# EasyEDA Pro project 小张FOC-STM32G431CBU6.epro, board PCB5
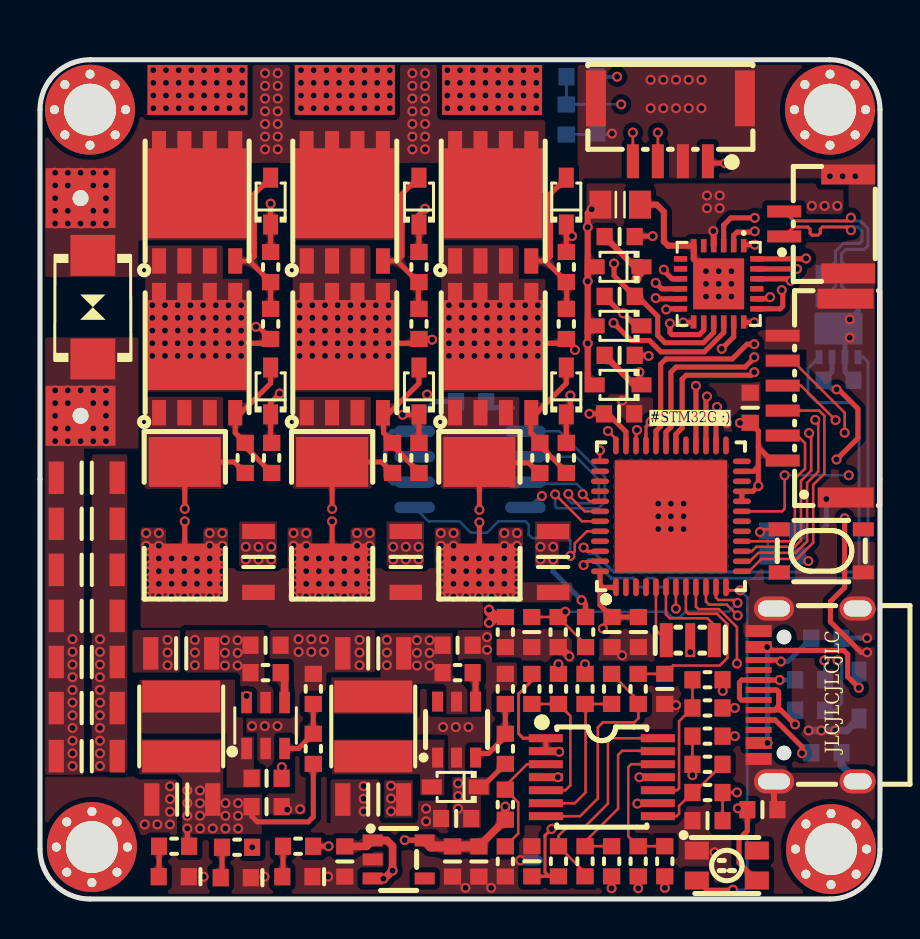
[diagram p13: board, top side]
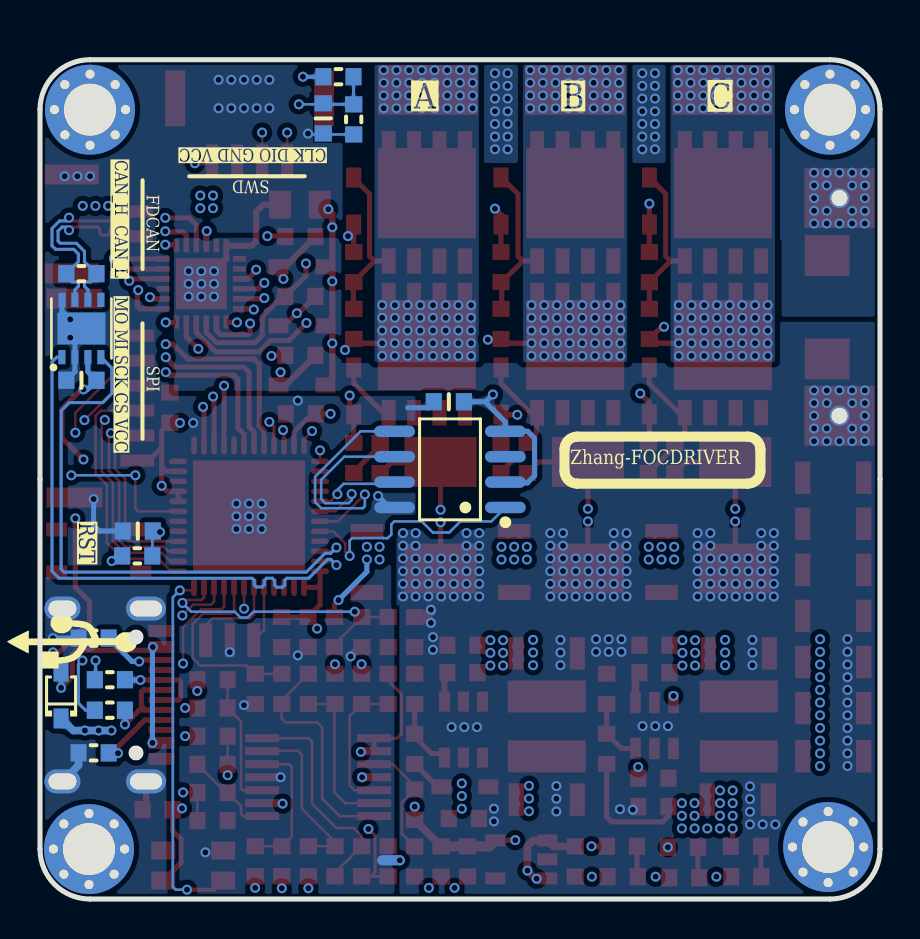
[diagram p14: board, bottom side, seen from below]

Outline 42 x 42 mm; copper layers: Top Layer, Inner1, Inner2, Bottom Layer. Coordinates in mm from the lower left corner of the outline.
Outline path: 0,39.5 0,2.5 arc(0.73,0.73) 2.5,0 39.5,0 arc(41.27,0.73) 42,2.5 42,39.5 arc(41.27,41.27) 39.5,42 2.5,42 arc(0.73,41.27) 0,39.5
Stack: Top Layer 0.035mm 外层铜厚1oz / Dielectric1 0.2104mm 7628 RC49% 8.6mil / Inner1 0.0152mm 内层铜厚 / Dielectric2 1.065mm 1.1mm H/HOZ Copper / Inner2 0.0152mm 内层铜厚 / Dielectric3 0.2104mm 7628 RC49% 8.6mil / Bottom Layer 0.035mm 外层铜厚1oz

## Design rules (mm)
net FDCAN_L: DP1
net FDCAN_H: DP1
net USB-DM: DP3
net USB-DP: DP3
net FDCAN_RX: DP2
net FDCAN_TX: DP2
template: 自定义配置
spacing copperThickness1oz (default): track to track 0.102, other pairs 0.102 to 0.127
spacing copperThickness2oz: track to track 0.203, other pairs 0.152 to 0.3
track width copperThickness1oz (default): min 0.127, default 0.127, max 2.54
track width copperThickness2oz: min 0.203, default 0.254, max 2.54
differential pair differentialPair (default): width min 0.127, default 0.152, max 2.54; gap min 0.152, default 0.152
via viaSize (default): diameter min 0.399, default 0.5, max 10; hole min 0.3, default 0.3, max 6.299

## Placement (name value [footprint] x y rotation side)
C5  100nF  [C0603_SMALL]  20.81 4.03 180 top
C6  100nF  [C0603_SMALL]  11.33 6.04 0 top
C8  1uF  [C0603_SMALL]  15.24 1.88 90 top
C9  1uF  [C0603_SMALL]  20.62 1.88 90 top
C16  100nF  [C0603_SMALL]  11.33 4.62 0 top
C17  10uF  [C1206_SMALL]  18.29 16.87 270 top
C18  10uF  [C1206_SMALL]  25.65 16.87 270 top
C19  10uF  [C1206_SMALL]  2.34 16.47 180 top
C20  10uF  [C1206_SMALL]  2.34 14.17 180 top
C21  10uF  [C1206_SMALL]  2.34 9.56 180 top
C22  10uF  [C1206_SMALL]  2.34 18.78 180 top
C23  10uF  [C1206_SMALL]  2.34 11.86 180 top
C24  10uF  [C1206_SMALL]  2.34 7.15 180 top
C25  10uF  [C1206_SMALL]  2.34 21.08 180 top
C26  10uF  [C1206_SMALL]  10.92 16.87 270 top
C27  100nF  [C0603_SMALL]  39.93 25.96 180 bottom
C28  100nF  [C0603_SMALL]  28.96 24.28 180 top
C29  100nF  [C0603_SMALL]  28.6 13.36 90 top
C30  100nF  [C0603_SMALL]  29.92 13.36 90 top
C31  100nF  [C0603_SMALL]  35.51 24.59 270 top
C34  1uF  [C0603_SMALL]  28.98 27.2 0 top
C35  1uF  [C0805_SMALL]  29.01 34.75 180 top
C36  100nF  [C0603_SMALL]  21.56 24.88 180 bottom
C37  1uF  [C0603_SMALL]  28.98 30.16 0 top
C38  1uF  [C0603_SMALL]  28.98 33.15 0 top
C43  100nF  [C0603_SMALL]  36.12 4.47 0 top
C44  100nF  [C0603_SMALL]  24.59 13.36 270 top
C45  100nF  [C0603_SMALL]  27.84 39.06 270 bottom
C62  1nF  [C0603_S]  31.24 10.52 90 top
C67  1nF  [C0603_S]  24.59 1.88 270 top
C68  1nF  [C0603_S]  33.38 3.92 0 top
C69  22uF  [C1206_SMALL]  7.06 12.29 180 top
C70  22uF  [C1206_SMALL]  7.11 4.98 180 top
C71  22uF  [C1206_SMALL]  16.66 12.29 180 top
C72  22uF  [C1206_SMALL]  16.66 4.98 180 top
C73  100nF  [C0603_SMALL]  11.28 12.7 0 top
C74  100nF  [C0603_SMALL]  20.88 12.7 0 top
C75  100nF  [C0603_SMALL]  21.95 1.88 270 top
C76  100nF  [C0603_SMALL]  37.11 18.42 180 bottom
CN1  WAFER-GH1.25-6PWB  [CONN-SMD_6P-P1.25_XUNPU_WAFER-GH1.25-6PWB]  38.71 25.07 90 top
CN2  X1251WRS-02HF-LPSW  [CONN-SMD_2P-P1.25_X1251WRS-02HF-LPSW]  38.81 33.78 90 top
D1  SMBJ28CA  [SMB_L4.6-W3.6-LS5.3-BI]  2.64 29.62 270 top
D2  B16WS  [SOD-323_L1.8-W1.3-LS2.5-RD]  28.9 25.73 180 top
D3  B16WS  [SOD-323_L1.8-W1.3-LS2.5-RD]  28.9 28.68 180 top
D4  B16WS  [SOD-323_L1.8-W1.3-LS2.5-RD]  40.94 10.21 90 bottom
D5  B16WS  [SOD-323_L1.8-W1.3-LS2.5-RD]  28.9 31.64 180 top
D6  B16WS  [SOD-323_L1.8-W1.3-LS2.5-RD]  11.53 34.93 90 top
D7  B16WS  [SOD-323_L1.8-W1.3-LS2.5-RD]  18.95 34.93 90 top
D8  B16WS  [SOD-323_L1.8-W1.3-LS2.5-RD]  26.31 34.93 90 top
D9  B16WS  [SOD-323_L1.8-W1.3-LS2.5-RD]  11.53 25.43 90 top
D10  B16WS  [SOD-323_L1.8-W1.3-LS2.5-RD]  18.95 25.43 90 top
D11  B16WS  [SOD-323_L1.8-W1.3-LS2.5-RD]  26.31 25.43 90 top
D13  B16WS  [SOD-323_L1.8-W1.3-LS2.5-RD]  20.76 5.61 180 top
L4  NCD0603R1  [LED0603_S]  13.5 1.12 0 top
L5  NCD0603R1  [LED0603_S]  7.31 1.12 0 top
L6  NCD0603R1  [LED0603_S]  10.41 1.07 0 top
L7  4.7uH  [IND-SMD_L4.0-W4.0_FNR40XXS]  7.06 8.64 270 top
L8  10uH  [IND-SMD_L4.0-W4.0_FNR40XXS]  16.66 8.64 270 top
LED1  XL-3528RGBW-WS2812B  [LED-SMD_4P-L3.5-W2.8-BR-1]  34.34 1.68 180 top
NOREF  -  [Pad_e358]  2.03 35.07 0 top
NOREF#2  -  [Pad_e196]  22.61 40.49 90 top
NOREF#3  -  [Pad_e381]  2.03 24.18 0 top
NOREF#4  -  [Pad_e195]  15.24 40.49 90 top
NOREF#5  -  [Pad_e181]  2.03 24.18 0 top
NOREF#6  -  [Pad_e194]  7.87 40.49 90 top
NOREF#7  -  [Pad_e180]  2.03 35.07 0 top
NTC1  NCP18XH103F03RB  [R0603_SMALL]  26.31 39.01 270 bottom
Q1  CSD18540Q5B  [VSON-CLIP-8_L5.0-W6.0-P1.27-BL]  7.86 34.93 0 top
Q2  CSD18540Q5B  [VSON-CLIP-8_L5.0-W6.0-P1.27-BL]  15.24 34.93 0 top
Q3  CSD18540Q5B  [VSON-CLIP-8_L5.0-W6.0-P1.27-BL]  22.66 34.93 0 top
Q4  CSD18540Q5B  [VSON-CLIP-8_L5.0-W6.0-P1.27-BL]  7.86 27.33 0 top
Q5  CSD18540Q5B  [VSON-CLIP-8_L5.0-W6.0-P1.27-BL]  15.24 27.33 0 top
Q6  CSD18540Q5B  [VSON-CLIP-8_L5.0-W6.0-P1.27-BL]  22.66 27.33 0 top
R2  100kΩ  [R0603_SMALL]  20.88 11.33 0 top
R3  200kΩ  [R0603_SMALL]  23.27 7.52 90 top
R4  10kΩ  [R0603_SMALL]  23.27 10.52 90 top
R6  100kΩ  [R0603_SMALL]  11.28 11.33 0 top
R7  52.3kΩ  [R0603_SMALL]  13.66 7.52 90 top
R8  10kΩ  [R0603_SMALL]  13.66 10.52 90 top
R9  120R  [R0603_SMALL]  39.93 31.29 0 bottom
R10  0Ω  [R0603_SMALL]  23.27 13.36 270 top
R11  4.7kΩ  [R0603_SMALL]  39.32 13.06 180 bottom
R12  22Ω  [R0603_SMALL]  38.51 9.45 0 bottom
R13  22Ω  [R0603_SMALL]  38.51 10.97 0 bottom
R14  4.7kΩ  [R0603_SMALL]  39.32 7.31 0 bottom
R19  22Ω  [R0603_SMALL]  11.53 31.62 270 top
R20  22Ω  [R0603_SMALL]  18.95 31.63 270 top
R21  22Ω  [R0603_SMALL]  26.31 31.63 270 top
R28  10kΩ  [R0603_SMALL]  11.53 28.78 90 top
R29  10kΩ  [R0603_SMALL]  18.95 28.78 90 top
R30  10kΩ  [R0603_SMALL]  26.31 28.78 90 top
R32  22Ω  [R0603_SMALL]  11.58 22.07 270 top
R33  22Ω  [R0603_SMALL]  18.95 22.07 270 top
R34  22Ω  [R0603_SMALL]  26.31 22.08 270 top
R37  10kΩ  [R0603_SMALL]  10.26 22.08 90 top
R38  10kΩ  [R0603_SMALL]  17.63 22.08 90 top
R39  10kΩ  [R0603_SMALL]  24.99 22.08 90 top
R42  100kΩ  [R0603_S]  28.58 10.52 270 top
R44  1mΩ  [RES-SMD_L6.4-W3.2_LR2512D-3W-1MR]  7.24 19.2 90 top
R45  1mΩ  [RES-SMD_L6.4-W3.2_LR2512D-3W-1MR]  14.6 19.2 90 top
R46  1mΩ  [RES-SMD_L6.4-W3.2_LR2512D-3W-1MR]  21.97 19.2 90 top
R48  10kΩ  [R0603_SMALL]  27.28 13.36 90 top
R49  10kΩ  [R0603_SMALL]  27.08 41.15 180 bottom
R50  1kΩ  [R0603_SMALL]  12.9 2.64 180 top
R51  1kΩ  [R0603_SMALL]  25.91 13.36 270 top
R52  1kΩ  [R0603_SMALL]  6.71 2.64 180 top
R53  1kΩ  [R0603_SMALL]  9.85 2.59 180 top
R55  100kΩ  [R0603_S]  24.59 10.52 270 top
R65  100kΩ  [R0603_S]  27.25 1.89 90 top
R66  100kΩ  [R0603_S]  33.38 6.74 180 top
R67  2kΩ  [R0603_S]  28.58 1.89 90 top
R68  2kΩ  [R0603_S]  33.38 8.15 180 top
R69  2kΩ  [R0603_S]  29.91 1.89 90 top
R70  22Ω  [R0603_S]  25.92 1.89 90 top
R71  100kΩ  [R0603_S]  31.24 1.89 90 top
R72  2kΩ  [R0603_S]  33.38 9.56 180 top
R73  22Ω  [R0603_S]  33.38 5.33 180 top
R74  100kΩ  [R0603_S]  33.38 10.97 180 top
R76  2kΩ  [R0603_S]  27.25 10.52 270 top
R78  2kΩ  [R0603_S]  25.92 10.52 270 top
R79  10kΩ  [R0603_S]  23.27 1.88 90 top
R81  22Ω  [R0603_S]  29.91 10.52 270 top
R82  10kΩ  [R0603_S]  23.27 4.72 270 top
R83  10kΩ  [R0603_S]  37.13 17.17 0 bottom
SW2  SKRPACE010  [KEY-SMD_4P-L4.2-W3.2-P2.20-LS4.6]  39.06 17.42 0 top
TP1  -  [M2.5螺丝孔]  2.5 39.5 0 top
TP2  -  [M2.5螺丝孔]  2.59 2.6 0 top
TP3  -  [M2.5螺丝孔]  39.55 2.5 0 top
TP4  -  [M2.5螺丝孔]  39.5 39.5 0 top
U2  STM32G431CBU6U  [UFQFPN-48_L7.0-W7.0-P0.50-BL-EP5.6]  31.55 19.15 0 top
U3  XC6210B332MR  [SOT-23-5_L3.0-W1.7-P0.95-LS2.8-BR]  17.93 1.98 180 top
U5  RY8411  [SOT-23-6_L2.9-W1.6-P0.95-LS2.8-BL]  11.28 8.68 0 top
U7  FD6288Q  [QFN-24_L4.0-W4.0-P0.50-BL-EP2.6]  33.93 30.78 180 top
U8  MT6816CT-ACD  [SOP-8_L5.0-W4.0-P1.27-LS6.0-BL]  21.5 21.5 90 bottom
U11  TJA1051TK/3/1J  [HVSON-8_L3.0-W3.0-P0.65-BL-EP]  39.93 28.55 180 bottom
U13  RS624XQ  [TSSOP-14_L5.0-W4.4-P0.65-LS6.4-BL]  28.09 6.1 270 top
U14  WAFER-GH1.25-4PWB  [CONN-SMD_4P-P1.25_XUNPU_WAFER-GH1.25-4PWB]  31.52 38.49 180 top
U19  MT3608  [SOT-23-6_L2.9-W1.6-P0.95-LS2.8-BR]  20.83 8.48 270 top
USBC1  TYPE-C-31-M-12  [USB-C_SMD-TYPE-C-31-M-12]  38.41 10.21 90 top
X1  20MHz  [OSC-SMD_3P-L3.2-W1.3-P1.2-L]  32.51 12.95 0 top

## Footprints (pads in the part's own frame, mm; a bottom-side part is the same pattern mirrored in y, then rotated)
C0603_S
  rect 0.806x0.864 smd: 1(-0.762,0) 2(0.745,0)
C0603_SMALL
  rect 0.806x0.864 smd: 1(-0.753,0) 2(0.753,0)
C0805_SMALL
  rect 1.1x1.399 smd: 1(-0.991,0) 2(0.991,0)
C1206_SMALL
  rect 0.762x1.625 smd: 1(-1.524,0) 2(1.524,0)
CONN-SMD_2P-P1.25_X1251WRS-02HF-LPSW
  rect 0.6x1.7 smd: 1(-0.625,1.6) 2(0.625,1.6)
  rect 1x2.7 smd: 3(2.475,-1.6) 4(-2.475,-1.6)
CONN-SMD_4P-P1.25_XUNPU_WAFER-GH1.25-4PWB
  rect 0.6x1.7 smd: 1(-1.875,1.575) 2(-0.625,1.575) 3(0.625,1.575) 4(1.875,1.575)
  rect 1x2.8 smd: 5(3.725,-1.575) 6(-3.725,-1.575)
CONN-SMD_6P-P1.25_XUNPU_WAFER-GH1.25-6PWB
  rect 0.6x1.7 smd: 1(-3.125,1.575) 2(-1.875,1.575) 3(-0.625,1.575) 4(0.625,1.575) 5(1.875,1.575) 6(3.125,1.575)
  rect 1x2.8 smd: 7(4.975,-1.575) 8(-4.975,-1.575)
HVSON-8_L3.0-W3.0-P0.65-BL-EP
  rect 0.355x0.711 smd: 1(-0.975,-1.433) 2(-0.325,-1.433) 3(0.325,-1.433) 4(0.975,-1.433) 5(0.975,1.433) 6(0.325,1.433) 7(-0.325,1.433) 8(-0.975,1.433)
  rect 2.4x1.6 smd: 9(0,0)
IND-SMD_L4.0-W4.0_FNR40XXS
  rect 1.6x3.9 smd: 1(-1.5,0) 2(1.5,0)
KEY-SMD_4P-L4.2-W3.2-P2.20-LS4.6
  rect 1.05x0.7 smd: 1(-2.1,1.075) 2(2.1,1.075) 3(-2.1,-1.075) 4(2.1,-1.075)
LED0603_S
  rect 0.806x0.864 smd: 1(-1.381,-0.001) 2(0.126,-0.001)
LED-SMD_4P-L3.5-W2.8-BR-1
  rect 1.2x0.9 smd: 1(1.5,-0.75) 2(1.5,0.75) 3(-1.5,0.75) 4(-1.5,-0.75)
M2.5螺丝孔
  round 0.635 hole 0.457: (-1.778,0) (-1.257,1.257) (-1.257,-1.257) (0,1.778) (0,-1.778) (1.257,1.257) (1.257,-1.257) (1.778,0)
  round 4.5 hole 2.6: 0(0,0)
OSC-SMD_3P-L3.2-W1.3-P1.2-L
  rect 0.65x1.7 smd: 1(-1.2,0) 3(1.2,0)
  rect 0.5x1.7 smd: 2(0,0)
Pad_e180
  rect 3.5x3 smd: 1(0,0)
Pad_e181
  rect 3.5x3 smd: 2(0,0)
Pad_e194
  rect 2.5x5 smd: 1(0,0)
Pad_e195
  rect 2.5x5 smd: 2(0,0)
Pad_e196
  rect 2.5x5 smd: 3(0,0)
Pad_e358
  round 1 hole 0.8: 1(0,0)
Pad_e381
  round 1 hole 0.8: 1(0,0)
QFN-24_L4.0-W4.0-P0.50-BL-EP2.6
  rect 0.28x0.665 smd: 1(-1.25,-1.907) 2(-0.75,-1.907) 3(-0.25,-1.907) 4(0.25,-1.907) 5(0.75,-1.907) 6(1.25,-1.907) 13(1.25,1.907) 14(0.75,1.907) 15(0.25,1.907) 16(-0.25,1.907) 17(-0.75,1.907) 18(-1.25,1.907)
  rect 0.665x0.28 smd: 7(1.907,-1.25) 8(1.907,-0.75) 9(1.907,-0.25) 10(1.907,0.25) 11(1.907,0.75) 12(1.907,1.25) 19(-1.907,1.25) 20(-1.907,0.75) 21(-1.907,0.25) 22(-1.907,-0.25) 23(-1.907,-0.75) 24(-1.907,-1.25)
  rect 2.55x2.55 smd: 25(0,0)
R0603_S
  rect 0.806x0.864 smd: 1(-0.752,0) 2(0.754,0)
R0603_SMALL
  rect 0.806x0.864 smd: 1(-0.753,0) 2(0.753,0)
RES-SMD_L6.4-W3.2_LR2512D-3W-1MR
  rect 2.5x3.6 smd: 1(-2.667,0) 2(2.667,0)
SMB_L4.6-W3.6-LS5.3-BI
  rect 2.047x2.241 smd: 1(-2.591,0) 2(2.591,0)
SOD-323_L1.8-W1.3-LS2.5-RD
  rect 1x0.75 smd: 1(-1.173,0) 2(1.173,0)
SOP-8_L5.0-W4.0-P1.27-LS6.0-BL
  oval 0.574x2.035 smd: 1(-1.905,-2.768) 2(-0.635,-2.768) 3(0.635,-2.768) 4(1.905,-2.768) 5(1.905,2.768) 6(0.635,2.768) 7(-0.635,2.768) 8(-1.905,2.768)
SOT-23-5_L3.0-W1.7-P0.95-LS2.8-BR
  rect 1x0.6 smd: 1(1.3,-0.95) 2(1.3,0) 3(1.3,0.95) 4(-1.3,0.95) 5(-1.3,-0.95)
SOT-23-6_L2.9-W1.6-P0.95-LS2.8-BL
  rect 0.532x1.072 smd: 1(-0.95,-1.149) 2(0,-1.149) 3(0.95,-1.149) 4(0.95,1.149) 5(0,1.149) 6(-0.95,1.149)
SOT-23-6_L2.9-W1.6-P0.95-LS2.8-BR
  rect 1x0.55 smd: 1(1.4,-0.95) 2(1.4,0) 3(1.4,0.95) 4(-1.4,0.95) 5(-1.4,0) 6(-1.4,-0.95)
TSSOP-14_L5.0-W4.4-P0.65-LS6.4-BL
  rect 0.4x1.7 smd: 1(-1.95,-2.8) 2(-1.3,-2.8) 3(-0.65,-2.8) 4(0,-2.8) 5(0.65,-2.8) 6(1.3,-2.8) 7(1.95,-2.8) 8(1.95,2.8) 9(1.3,2.8) 10(0.65,2.8) 11(0,2.8) 12(-0.65,2.8) 13(-1.3,2.8) 14(-1.95,2.8)
UFQFPN-48_L7.0-W7.0-P0.50-BL-EP5.6
  oval 0.28x0.9 smd: 1(-2.751,-3.547) 2(-2.251,-3.547) 3(-1.75,-3.547) 4(-1.25,-3.547) 5(-0.75,-3.547) 6(-0.249,-3.547) 7(0.249,-3.547) 8(0.75,-3.547) 9(1.25,-3.547) 10(1.75,-3.547) 11(2.251,-3.547) 12(2.751,-3.547) 25(2.751,3.547) 26(2.251,3.547) 27(1.75,3.547) 28(1.25,3.547) 29(0.75,3.547) 30(0.249,3.547) 31(-0.249,3.547) 32(-0.75,3.547) 33(-1.25,3.547) 34(-1.75,3.547) 35(-2.251,3.547) 36(-2.751,3.547)
  oval 0.9x0.28 smd: 13(3.547,-2.75) 14(3.547,-2.25) 15(3.547,-1.75) 16(3.547,-1.25) 17(3.547,-0.75) 18(3.547,-0.25) 19(3.547,0.25) 20(3.547,0.75) 21(3.547,1.25) 22(3.547,1.75) 23(3.547,2.25) 24(3.547,2.75) 37(-3.547,2.751) 38(-3.547,2.251) 39(-3.547,1.75) 40(-3.547,1.25) 41(-3.547,0.75) 42(-3.547,0.249) 43(-3.547,-0.249) 44(-3.547,-0.75) 45(-3.547,-1.25) 46(-3.547,-1.75) 47(-3.547,-2.251) 48(-3.547,-2.751)
  rect 5.6x5.6 smd: 49(0,0)
USB-C_SMD-TYPE-C-31-M-12
  oval 1.2x2 hole 0.8x1.6: 0(-4.325,1.706) 1(4.325,1.706)
  oval 1.2x1.8 hole 0.8x1.4: 2(4.325,-2.474) 3(-4.325,-2.474)
  rect 0.3x1.3 smd: A1(-3.35,2.474) A4(-2.55,2.474) A5(-1.25,2.474) A6(-0.25,2.474) A7(0.25,2.474) A8(1.25,2.474) A9(2.55,2.474) A12(3.35,2.474) B1(3.05,2.474) B4(2.25,2.474) B5(1.75,2.474) B6(0.75,2.474) B7(-0.75,2.474) B8(-1.75,2.474) B9(-2.25,2.474) B12(-3.05,2.474)
VSON-CLIP-8_L5.0-W6.0-P1.27-BL
  rect 0.7x1.27 smd: 1(-1.904,-3) 2(-0.636,-3) 3(0.636,-3) 4(1.906,-3)
  rect 0.7x1 smd: 5(1.904,3) 6(0.634,3) 7(-0.636,3) 8(-1.906,3)
  rect 4.9x4.5 smd: 8(-0.001,0.39)

## Nets
As in the schematic, except:
PGND: C5.2 C16.2 C17.2 C18.2 C19.2 C20.2 C21.2 C22.2 C23.2 C24.2 C25.2 C26.2 C35.1 C69.2 C70.2 C71.2 C72.2 C73.2 C74.2 D1.2 NOREF#3.1 NOREF#5.2 R4.2 R8.2 R10.1 R44.1 R45.1 R46.1 R67.1 R68.1 R76.1 U5.2 U7.6 U7.25 U19.2
DCBUS: C17.1 C18.1 C19.1 C20.1 C21.1 C22.1 C23.1 C24.1 C25.1 C26.1 C69.1 C73.1 D1.1 NOREF.1 NOREF#7.1 Q1.5 Q1.6 Q1.7 Q1.8 Q2.5 Q2.6 Q2.7 Q2.8 Q3.5 Q3.6 Q3.7 Q3.8 R6.1 R48.2 U5.5
SH_A: C34.2 NOREF#2.3 Q3.1 Q3.2 Q3.3 Q6.5 Q6.6 Q6.7 Q6.8 R30.1 U7.18
SH_B: C37.2 NOREF#4.2 Q2.1 Q2.2 Q2.3 Q5.5 Q5.6 Q5.7 Q5.8 R29.1 U7.15
SH_C: C38.2 NOREF#6.1 Q1.1 Q1.2 Q1.3 Q4.5 Q4.6 Q4.7 Q4.8 R28.1 U7.12

Pads without a net: LED1 4; SW2 2 3; TP1 0; TP2 0; TP3 0; TP4 0; U2 3 4 17 18 25 29 38 39 40 45; U3 4; U7 5 7 8 21; U8 3; U11 5; U19 6; USBC1 A8 B8

## Via types
v1: diameter 0.5, hole 0.299, Top Layer to Bottom Layer, 688 vias

## Routing (per net, layer and track width the routed paths; a pad name or vN(x,y) marks a point on that pad's centre or on a via; arc(x,y) is an arc through that point)
5V: length 37.4
  Top Layer w0.254: v1(40.23,19.05) 40.23,15.6 39.52,14.88 39.52,13.87 41.05,12.34 v1(41.35,12.34) ; R7.1 13.66,4.11 13.41,3.86 10.87,3.86 10.58,4.16 C16.1 ; 7.46,2.64 7.37,2.73 v1(7.37,3.53) ; LED1.3 34.95,1.82 34.95,3 35.37,3.41 C43.1 35.3,4.54 v1(34.9,4.54) ; v1(39.83,25.5) 39.93,25.5 40.89,24.54 40.89,23.06 v1(39.83,22)
  Top Layer w0.381: C8.2 16.33,2.63 U3.1 17.35,2.93 17.63,2.65 v1(17.63,1.42) 17.22,1.02 v1(17.17,1.02) 16.65,1.02 16.63,1.03
  Inner2 w0.254: v1(39.83,22) 39.83,19.46 v1(40.23,19.05)
  Bottom Layer w0.254: v1(39.83,25.5) 39.63,25.5 C27.2 39.6,26.39 U11.3
  Bottom Layer w0.381: D4.1 40.34,8.43 v1(39.75,8.43) v1(39.06,8.43) v1(38.43,8.43)
  vias: v1(7.37,5.44) v1(7.37,4.8) v1(7.37,4.17) v1(8,5.44) v1(8,4.8) v1(8,4.17) v1(8,3.53) v1(8.64,3.53) v1(9.27,4.8) v1(9.27,4.17) v1(9.27,3.53) v1(9.91,4.8) v1(9.91,4.17) v1(9.91,3.53) v1(17.35,12.97) v1(17.35,12.33) v1(17.35,11.7) v1(18.85,12.95) v1(18.85,12.32) v1(18.85,11.68) v1(19.48,12.95) v1(19.48,12.32) v1(19.48,11.68)
12V: length 21.2
  Top Layer w0.254: R3.1 22.11,5.61 D13.1
  Top Layer w0.305: v1(33.66,33.43) 33.68,33.41 U7.4 ; 27.39,28.34 v1(27.39,27.81) 27.39,26.07 D2.2 ; 27.39,28.34 D3.2 ; 27.39,28.34 v1(27.39,30.91) 27.39,31.29 ; 27.39,31.29 D5.2 ; 27.39,31.29 v1(27.39,33.62) 27.39,34.32 v1(27.59,34.52) 28.02,34.95
  Inner2 w0.203: v1(10.61,2.59) 13.36,2.59 14.28,3.5 17.22,3.5 17.55,3.84 v1(17.55,4.39)
  vias: v1(17.55,5.66) v1(17.55,5.03) v1(20.91,5.79) v1(20.91,5.15) v1(20.91,4.52) v1(33.35,35.2) v1(33.35,34.57) v1(33.99,35.2) v1(33.99,34.57) v1(38.59,34.69) v1(39.23,34.69) v1(39.86,34.69)
GND: length 19
  Top Layer w0.127: C62.1 31.74,9.76 v1(31.8,9.7)
  Top Layer w0.254: v1(39.32,20.02) 39.4,20.09 CN1.8
  Top Layer w0.305: C43.2 36.7,4.64 USBC1.0
  Top Layer w0.381: v1(26.47,12.14) 26,12.61 R51.2
  Bottom Layer w0.127: 26.31,38.26 28.56,38.26 v1(28.6,38.3)
  Bottom Layer w0.254: U11.8 40.9,29.42 v1(40.49,29.01) ; C76.1 39.04,18.42 39.32,18.69 v1(39.32,20.02) ; 23.62,24.59 22.61,24.59 C36.1 ; R11.1 v1(41.35,13.06) ; U8.8 24.52,19.59 v1(25.09,20.17) ; C27.1 40.25,26.39 U11.2 40.25,27.86 v1(40.49,28.09)
  Bottom Layer w0.381: USBC1.3 40.07,6.69 R14.2
  Bottom Layer w0.508: 24.89,1.94 v1(24.01,1.94)
  vias: v1(8.18,1.12) v1(11.22,1.12) v1(14.41,1.12) v1(21.27,0.56) v1(22.56,0.56) v1(29.11,24.94) v1(29.11,12.19) v1(29.97,6.1) v1(30.53,41) v1(30.53,39.57) v1(30.91,19.79) v1(30.91,19.15) v1(30.91,18.52) v1(31.17,41) v1(31.17,39.57) v1(31.55,19.79) v1(31.55,19.15) v1(31.55,18.52) v1(31.8,41) v1(31.8,39.57) v1(32.18,19.79) v1(32.18,19.15) v1(32.18,18.52) v1(32.44,41) v1(32.44,39.57) v1(32.51,12.36) v1(33.07,41) v1(33.07,39.57) v1(33.73,2.34) v1(34.34,23.83) v1(39.5,36.17) v1(40.13,36.17) v1(40.77,36.17)
PGND: length 125.7
  Top Layer w0.254: R76.1 v1(27.25,11.75) ; R45.1 v1(14.6,18.9) ; R44.1 v1(7.24,18.9) ; 21.97,16.49 v1(21.97,18.85) ; R68.1 v1(34.74,8.15) ; R67.1 v1(28.58,0.54)
  Top Layer w0.305: v1(33.93,30.78) v1(33.3,31.42) 32.68,32.03 U7.6 31.41,32.69 31.19,32.91 31.19,34.39 30.84,34.75 C35.1
  Top Layer w0.508: v1(22.45,13.82) 22.75,14.11 ; 22.75,14.11 R10.1 ; 22.75,14.11 22.45,14.41 v1(22.45,14.48)
  Inner2 w0.152: v1(14.6,18.9) 14.81,18.9 16.64,20.73 27.99,20.73 28.68,20.04 28.68,13.43 28.33,13.08 25.09,13.08 24.84,12.84 24.84,9.54 25.63,8.76 34.14,8.76 v1(34.74,8.15) ; v1(21.97,18.85) 22.13,19.01 26.56,19.01 27.69,17.88 27.69,14.15 27.42,13.88 24.55,13.88 24.18,13.51 24.18,2.62 25.02,1.78 28.78,1.78 29.06,1.5 29.06,0.65 28.95,0.54 v1(28.58,0.54) ; v1(7.24,18.9) 7.4,19.06 7.91,19.06 10.34,21.49 28.8,21.49 29.6,20.69 29.6,11.04 29.18,10.61 26.85,10.61 26.74,10.72 26.74,11.24 v1(27.25,11.75)
  vias: v1(0.76,25.45) v1(0.76,24.82) v1(0.76,24.18) v1(0.76,23.55) v1(0.76,22.91) v1(1.39,25.45) v1(1.39,24.82) v1(1.39,23.55) v1(1.39,22.91) v1(1.63,13) v1(1.63,12.37) v1(1.63,11.73) v1(1.63,11.1) v1(1.63,10.47) v1(1.63,9.83) v1(1.63,9.19) v1(1.63,8.56) v1(1.63,7.92) v1(1.63,7.29) v1(1.63,6.66) v1(2.03,25.45) v1(2.03,22.91) v1(2.66,25.45) v1(2.66,24.82) v1(2.66,23.55) v1(2.66,22.91) v1(3.3,25.45) v1(3.3,24.82) v1(3.3,24.18) v1(3.3,23.55) v1(3.3,22.91) v1(5.23,3.73) v1(5.31,18.31) v1(5.31,17.68) v1(5.31,17.04) v1(5.31,16.41) v1(5.31,15.77) v1(5.31,15.14) v1(5.94,18.31) v1(5.94,17.68) v1(5.94,17.04) v1(5.94,16.41) v1(5.94,15.77) v1(5.94,15.14) v1(5.87,3.73) v1(6.38,12.97) v1(6.38,12.33) v1(6.38,11.7) v1(6.5,5.64) v1(6.5,5) v1(6.5,4.37) v1(6.5,3.73) v1(6.58,17.04) v1(6.58,16.41) v1(6.58,15.77) v1(6.58,15.14) v1(7.21,17.04) v1(7.21,16.41) v1(7.21,15.77) v1(7.21,15.14) v1(7.85,17.04) v1(7.85,16.41) v1(7.85,15.77) v1(7.85,15.14) v1(8.48,18.31) v1(8.48,17.68) v1(8.48,17.04) v1(8.48,16.41) v1(8.48,15.77) v1(8.48,15.14) v1(9.12,18.31) v1(9.12,17.68) v1(9.12,17.04) v1(9.12,16.41) v1(9.12,15.77) v1(9.12,15.14) v1(10.6,8.65) v1(11.24,8.65) v1(11.87,8.65) v1(12.36,4.47) v1(12.67,18.31) v1(12.67,17.68) v1(12.67,17.04) v1(12.67,16.41) v1(12.67,15.77) v1(12.67,15.14) v1(12.93,13) v1(12.93,12.37) v1(13,4.5) v1(13.31,18.31) v1(13.31,17.68) v1(13.31,17.04) v1(13.31,16.41) v1(13.31,15.77) v1(13.31,15.14) v1(13.56,13) v1(13.56,12.37) v1(13.94,17.04) v1(13.94,16.41) v1(13.94,15.77) v1(13.94,15.14) v1(14.2,13) v1(14.2,12.37) v1(14.58,17.04) v1(14.58,16.41) v1(14.58,15.77) v1(14.58,15.14) v1(15.21,17.04) v1(15.21,16.41) v1(15.21,15.77) v1(15.21,15.14) v1(15.85,18.31) v1(15.85,17.68) v1(15.85,17.04) v1(15.85,16.41) v1(15.85,15.77) v1(15.85,15.14) v1(15.98,12.97) v1(15.98,12.33) v1(15.98,11.7) v1(16.18,5.65) v1(16.18,5.02) v1(16.18,4.38) v1(16.48,18.31) v1(16.48,17.68) v1(16.48,17.04) v1(16.48,16.41) v1(16.48,15.77) v1(16.48,15.14) v1(19.3,4.52) v1(19.3,3.89) v1(20.04,18.31) v1(20.04,17.68) v1(20.04,17.04) v1(20.04,16.41) v1(20.04,15.77) v1(20.04,15.14) v1(20.15,8.61) v1(20.68,18.31) v1(20.68,17.68) v1(20.68,17.04) v1(20.68,16.41) v1(20.68,15.77) v1(20.68,15.14) v1(20.79,8.61) v1(21.31,17.04) v1(21.31,16.41) v1(21.31,15.77) v1(21.31,15.14) v1(21.42,8.61) v1(21.95,17.04) v1(21.95,16.41) v1(21.95,15.77) v1(21.95,15.14) v1(22.35,13.11) v1(22.35,12.47) v1(22.58,17.04) v1(22.58,16.41) v1(22.58,15.77) v1(22.58,15.14) v1(23.22,18.31) v1(23.22,17.68) v1(23.22,17.04) v1(23.22,16.41) v1(23.22,15.77) v1(23.22,15.14) v1(23.85,18.31) v1(23.85,17.68) v1(23.85,17.04) v1(23.85,16.41) v1(23.85,15.77) v1(23.85,15.14) v1(33.3,30.78) v1(33.3,30.15) v1(33.93,31.42) v1(33.93,30.15) v1(34.57,31.42) v1(34.57,30.78) v1(34.57,30.15)
VBUS: length 14.1
  Top Layer w0.127: v1(34.88,14.82) 34.73,14.96 33.92,14.96 33.8,15.09 33.8,15.6 ; R48.1 27.28,12.74 R51.1 C44.1
  Bottom Layer w0.127: v1(26.26,14.38) 31.32,14.38 31.61,14.09 31.98,14.09 32.27,14.38 34.44,14.38 v1(34.88,14.82)
VCC: length 46
  Top Layer w0.254: U3.5 18.63,2.93 18.61,2.95 v1(18.24,2.95) ; 35.92,21.64 35.92,22.6 ; 35.92,21.64 v1(35.92,20.68) 35.64,20.4 U2.21 U2.20 ; 35.92,21.64 35.68,21.4 U2.23 ; 35.92,22.6 35.92,23.43 35.51,23.83 35.5,23.83 v1(35,23.83) ; 35.92,22.6 36.57,21.94 CN1.1 ; C30.2 C29.2 28,14.71 28,15.74 ; 28,15.74 28.14,15.6 28.79,15.6 U2.1 ; 28,15.74 U2.48 ; v1(27.47,24.28) C28.2 28.4,24.28 29.3,23.38 U2.35 ; R50.1 v1(14.43,2.64) ; 33.43,36.83 34.24,36.83 v1(34.26,36.82)
  Top Layer w0.381: C75.1 22.1,2.78 22.1,2.79 23.27,3.96 v1(23.27,4.62)
  Top Layer w0.508: U3.5 19.53,2.63 C9.2 C75.1
  Inner2 w0.254: v1(27.47,24.28) 20.32,24.28 v1(19.35,25.25) ; v1(14.43,2.64) 14.73,2.95 v1(18.24,2.95)
  Bottom Layer w0.203: v1(28.85,41.15) R49.1
  Bottom Layer w0.254: v1(38.41,16.91) 38.16,17.17 37.89,17.17 ; 19.75,24.88 19.72,24.88 v1(19.35,25.25) ; 19.75,24.88 C36.2 ; 19.75,24.88 18.73,23.87 U8.4 17.61,23.41 17.27,23.06 17.27,21.18 17.63,20.83 18.69,20.83 U8.2
  vias: v1(25.89,6.1) v1(28.14,13.53)
DCBUS: length 3.5
  Top Layer w0.254: R48.2 27.28,14.76 v1(27.08,14.96)
  Bottom Layer w0.254: v1(25.66,16.99) 25.66,16.38 v1(27.08,14.96)
  vias: v1(0.76,36.34) v1(0.76,35.71) v1(0.76,35.07) v1(0.76,34.44) v1(0.76,33.8) v1(1.39,36.34) v1(1.39,35.71) v1(1.39,34.44) v1(1.39,33.8) v1(2.03,36.34) v1(2.03,33.8) v1(2.66,36.34) v1(2.66,35.71) v1(2.66,34.44) v1(2.66,33.8) v1(3,13) v1(3,12.37) v1(3,11.73) v1(3,11.1) v1(3,10.47) v1(3,9.83) v1(3,9.19) v1(3,8.56) v1(3,7.92) v1(3,7.29) v1(3,6.66) v1(3.3,36.34) v1(3.3,35.71) v1(3.3,35.07) v1(3.3,34.44) v1(3.3,33.8) v1(7.75,12.97) v1(7.75,12.33) v1(7.75,11.7) v1(9.25,12.95) v1(9.25,12.32) v1(9.25,11.68) v1(9.88,12.95) v1(9.88,12.32) v1(9.88,11.68) v1(10.29,17.62) v1(10.29,16.99) v1(10.93,17.62) v1(10.93,16.99) v1(11.25,41.33) v1(11.25,40.69) v1(11.25,40.06) v1(11.25,39.42) v1(11.25,38.79) v1(11.25,38.15) v1(11.25,37.52) v1(11.56,17.62) v1(11.56,16.99) v1(11.89,41.33) v1(11.89,40.69) v1(11.89,40.06) v1(11.89,39.42) v1(11.89,38.79) v1(11.89,38.15) v1(11.89,37.52) v1(17.66,17.62) v1(17.66,16.99) v1(18.29,17.62) v1(18.29,16.99) v1(18.62,41.33) v1(18.62,40.69) v1(18.62,40.06) v1(18.62,39.42) v1(18.62,38.79) v1(18.62,38.15) v1(18.62,37.52) v1(18.93,17.62) v1(18.93,16.99) v1(19.25,41.33) v1(19.25,40.69) v1(19.25,40.06) v1(19.25,39.42) v1(19.25,38.79) v1(19.25,38.15) v1(19.25,37.52) v1(25.02,17.62) v1(25.02,16.99) v1(25.66,17.62)
FDCAN_H: length 10
  Top Layer w0.152: CN2.2 37.68,33.93 40.39,33.93 v1(40.55,34.1)
  Bottom Layer w0.152: v1(40.55,34.1) 40.71,33.93 41.02,33.93 41.4,33.55 41.4,32.69 41.22,32.51 40.31,32.51 40.08,32.28 40.08,31.89 R9.2 40.68,31.17 40.4,30.88 40.15,30.88 40.08,30.81 40.08,30.66 40.25,30.49 U11.7
FDCAN_L: length 10
  Top Layer w0.152: CN2.1 37.68,33.63 38.4,33.63 38.5,33.52 38.5,33.33 38.61,33.22 38.9,33.22 39.01,33.33 39.01,33.52 39.12,33.63 40.39,33.63 v1(40.55,33.47)
  Bottom Layer w0.152: U11.6 39.6,30.49 39.78,30.66 39.78,30.81 39.71,30.88 39.46,30.88 39.18,31.17 R9.1 39.78,31.89 39.78,32.41 40.18,32.82 40.99,32.82 41.1,32.92 41.1,33.43 40.89,33.63 40.71,33.63 v1(40.55,33.47)
FDCAN_RX: length 28.1
  Top Layer w0.152: v1(27.18,17.59) 27.37,17.4 U2.46
  Bottom Layer w0.152: v1(27.18,17.59) 27.46,17.3 27.74,17.3 28.69,16.36 40.79,16.36 40.94,16.51 40.94,24.44 40.54,24.84 38.86,24.84 38.41,25.3 38.41,26.57 U11.4
FDCAN_TX: length 28.1
  Top Layer w0.152: U2.47 27.37,16.9 v1(27.18,16.71)
  Bottom Layer w0.152: U11.1 41.16,27.12 41.4,26.87 41.4,16.41 41.05,16.05 31.4,16.05 31.29,15.94 31.29,15.73 31.18,15.62 30.89,15.62 30.78,15.73 30.78,15.94 30.68,16.05 30.38,16.05 30.27,15.94 30.27,15.71 30.17,15.6 29.87,15.6 29.77,15.71 29.77,15.94 29.66,16.05 28.56,16.05 27.62,17 27.46,17 v1(27.18,16.71)
GH_A: length 18
  Top Layer w0.254: U7.19 37,29.53 37.13,29.67 37.13,30.42 v1(37.09,30.47) ; R21.1 26.31,33.46 ; 26.31,33.46 D8.1 ; 26.31,33.46 v1(26.6,33.17)
  Inner2 w0.254: v1(26.6,33.17) 26.6,32.63 31.14,28.09 33.63,28.09 36.22,30.68 36.88,30.68 v1(37.09,30.47)
GH_B: length 22.6
  Top Layer w0.254: v1(19.25,34.54) 18.95,34.24 D7.1 R20.1 ; U7.16 34.19,28.87 34.19,28.35 33.22,27.38 31.04,27.38 30.47,27.95 29.56,27.95 v1(28.68,28.83)
  Inner2 w0.254: v1(19.25,34.54) 25.55,34.54 26.01,34.09 26.01,31.5 v1(28.68,28.83)
GH_C: length 32.2
  Top Layer w0.254: U7.13 32.66,28.85 v1(32.16,28.85) ; v1(11.53,34.8) D6.1 11.53,32.38
  Inner2 w0.254: v1(32.16,28.85) 32.16,36.32 31.55,36.93 13.82,36.93 11.68,34.8 v1(11.53,34.8)
GL_A: length 10.4
  Top Layer w0.254: v1(30.78,30.07) 30.84,30.07 30.87,30.03 32.03,30.03 ; 26.37,22.83 26.31,22.88 D11.1 26.52,24.46 v1(26.52,25.2)
  Inner1 w0.254: v1(26.52,25.2) 30.78,29.46 v1(30.78,30.07)
GL_B: length 31.2
  Top Layer w0.254: 19,22.83 18.95,22.88 D10.1 18.93,24.23 v1(18.14,24.23) ; U7.10 31.08,30.53 v1(30.78,30.83)
  Inner2 w0.254: v1(18.14,24.23) 18.14,35.31 18.39,35.56 29.16,35.56 29.51,35.2 29.51,32.1 v1(30.78,30.83)
GL_C: length 35.7
  Top Layer w0.254: 32.03,31.03 31.6,31.03 31.19,31.44 v1(31.19,31.49) ; v1(11.99,25.3) 11.53,24.84 D9.1 11.53,22.88 11.58,22.83
  Inner2 w0.254: v1(31.19,31.49) 30.02,32.66 30.02,35.51 29.51,36.02 14.58,36.02 11.99,33.43 v1(11.99,25.3)
HIN1: length 15.6
  Top Layer w0.254: v1(35.71,27.77) 35.35,27.77 34.61,27.03 31.29,27.03 31.03,26.77 31.03,23.67 30.8,23.43 U2.32 ; v1(37.54,30.94) 37.44,31.03 35.84,31.03
  Inner2 w0.254: v1(37.54,30.94) 37.59,30.89 37.59,28.5 36.86,27.77 v1(35.71,27.77)
HIN2: length 16.4
  Top Layer w0.254: v1(35.71,27.11) 35.71,27.08 35.25,26.62 31.8,26.62 31.55,26.36 31.55,23.62 31.3,23.37 U2.31 ; U7.23 35.85,31.53 v1(37.85,31.53)
  Inner2 w0.254: v1(35.71,27.11) 36.92,27.11 38.05,28.25 38.05,31.33 v1(37.85,31.53)
HIN3: length 17.5
  Top Layer w0.254: v1(38.3,32.06) 38.28,32.03 35.84,32.03 ; U2.30 31.8,23.26 32.11,23.57 32.11,26.01 32.31,26.21 35.56,26.21 v1(35.71,26.36)
  Inner2 w0.254: v1(38.3,32.06) 38.51,31.85 38.51,27.64 37.24,26.36 v1(35.71,26.36)
IA: length 27.9
  Top Layer w0.127: v1(34.88,14.19) 34.34,14.73 33.45,14.73 33.3,14.89 U2.10
  Top Layer w0.152: 25.92,1.14 25.45,1.14 ; 25.45,1.14 25.25,1.34 25.25,3.17 v1(25.58,3.5) ; 25.45,1.14 24.59,1.14
  Inner2 w0.127: v1(34.88,14.19) 34.88,12.51 35.15,12.24 35.76,12.24 35.92,12.09 35.92,7.26 35.46,6.81 35.46,3.78 35.18,3.5 v1(25.58,3.5)
IA+: length 38.2
  Top Layer w0.254: R69.1 v1(29.91,0.54) ; v1(21.97,19.48) 21.97,21.82 24.44,21.82 24.99,21.28
  Inner2 w0.152: v1(29.91,0.54) 29.5,0.54 29.36,0.68 29.36,1.63 28.91,2.08 25.15,2.08 24.44,2.79 24.44,13.31 24.7,13.58 27.55,13.58 27.99,14.02 27.99,18.03 26.71,19.32 22.13,19.32 v1(21.97,19.48)
IB: length 14.8
  Top Layer w0.127: v1(34.85,5.33) 34.85,5.33 R73.1 ; v1(34.85,11.79) 34.85,13.6 33.94,14.51 32.92,14.51 32.8,14.63 U2.9 ; 34.13,5.33 C68.2
  Inner2 w0.127: v1(34.85,11.79) 35.46,11.79 35.61,11.63 35.61,7.42 34.85,6.66 v1(34.85,5.33)
IB+: length 45.9
  Top Layer w0.254: 34.23,9.56 v1(34.74,9.56) ; v1(14.6,19.53) R45.2 17.08,21.87 R38.1
  Inner2 w0.152: v1(14.6,19.53) 14.77,19.36 14.92,19.36 16.64,21.08 28.04,21.08 28.99,20.13 28.99,13.3 28.36,12.66 25.27,12.66 25.16,12.55 25.16,9.59 25.74,9.01 34.64,9.01 34.74,9.12 v1(34.74,9.56)
IC: length 10
  Top Layer w0.127: U2.8 32.3,14.39 32.41,14.28 33.85,14.28 34.37,13.76 34.37,12.07 33.99,11.68 31.65,11.68 C62.2 29.91,11.27
IC+: length 45.3
  Top Layer w0.254: v1(7.24,19.53) R44.2 9.71,21.87 R37.1 ; R78.1 v1(25.92,11.75)
  Inner2 w0.152: v1(25.92,11.75) 26.44,11.24 26.44,10.59 26.72,10.31 29.31,10.31 29.91,10.91 29.91,20.79 28.91,21.79 10.21,21.79 7.78,19.36 7.4,19.36 v1(7.24,19.53)
LIN1: length 18.9
  Top Layer w0.254: v1(35.74,32.74) 35.24,32.74 U7.1 ; U2.28 v1(32.8,25.68)
  Inner2 w0.254: v1(32.8,25.68) 37.47,25.68 38.96,27.18 38.96,32.26 38.48,32.74 v1(35.74,32.74)
LIN2: length 20.8
  Top Layer w0.254: v1(35.74,33.42) 35.7,33.38 34.85,33.38 34.68,33.21 U7.2 ; U2.27 33.3,25.09 v1(33.35,25.15)
  Inner2 w0.254: v1(33.35,25.15) 37.74,25.15 39.42,26.82 39.42,32.72 38.72,33.42 v1(35.74,33.42)
LIN3: length 22.7
  Top Layer w0.254: 33.8,22.7 33.8,24.58 v1(33.85,24.63) ; U7.3 34.18,33.73 34.54,34.09 v1(35.74,34.09)
  Inner2 w0.254: v1(33.85,24.63) 38.04,24.63 39.88,26.47 39.88,33.17 38.96,34.09 v1(35.74,34.09)
NRST: length 11.3
  Top Layer w0.127: SW2.1 36.14,18.5 v1(36,18.36) ; U2.7 v1(31.8,14.53)
  Inner2 w0.127: v1(31.8,14.53) 31.8,16.35 31.9,16.46 35.87,16.46 36,16.59 v1(36,18.36)
  Bottom Layer w0.127: R83.1 36.38,18.39 C76.2
NTC1: length 41.4
  Top Layer w0.127: U2.19 37.11,19.4 37.23,19.53 v1(37.23,21.2)
  Inner2 w0.127: v1(40.44,21.2) 41.18,21.2 41.48,21.51 41.48,36.45 41.2,36.73 38.2,36.73 34.65,40.28 29.57,40.28 v1(29.06,39.77)
  Bottom Layer w0.127: v1(40.44,21.2) v1(37.23,21.2) ; 27.89,39.77 v1(29.06,39.77)
  Bottom Layer w0.152: 27.79,39.77 NTC1.1 26.32,39.78 R49.2
OSC_IN: length 2.9
  Top Layer w0.127: X1.1 30.8,13.47 U2.5
OSC_OUT: length 4.8
  Top Layer w0.127: X1.3 33.71,13.71 33.37,14.05 31.49,14.05 31.3,14.24 U2.6
SH_A: length 14.2
  Top Layer w0.254: v1(30.43,27.18) 30.4,27.21 29.74,27.21 ; v1(26.75,27.48) 26.75,27.59 R30.1 26.1,27.81 24.84,27.81 ; v1(35.71,28.85) 35.21,28.85 U7.18
  Inner2 w0.254: v1(35.71,28.85) 35.15,28.85 34.65,28.35 34.65,27.18 34.39,26.92 30.68,26.92 v1(30.43,27.18) 27.05,27.18 v1(26.75,27.48)
  vias: v1(20.37,41.48) v1(20.37,40.84) v1(20.37,40.21) v1(20.37,39.57) v1(20.45,29.72) v1(20.45,29.08) v1(20.45,28.45) v1(20.45,27.81) v1(20.45,27.18) v1(21,41.48) v1(21,40.84) v1(21,40.21) v1(21,39.57) v1(21.08,29.72) v1(21.08,29.08) v1(21.08,28.45) v1(21.08,27.81) v1(21.08,27.18) v1(21.64,41.48) v1(21.64,40.84) v1(21.64,40.21) v1(21.64,39.57) v1(21.72,29.72) v1(21.72,29.08) v1(21.72,28.45) v1(21.72,27.81) v1(21.72,27.18) v1(22.27,41.48) v1(22.27,40.84) v1(22.27,40.21) v1(22.27,39.57) v1(22.35,29.72) v1(22.35,29.08) v1(22.35,28.45) v1(22.35,27.81) v1(22.35,27.18) v1(22.91,41.48) v1(22.91,40.84) v1(22.91,40.21) v1(22.91,39.57) v1(22.99,29.72) v1(22.99,29.08) v1(22.99,28.45) v1(22.99,27.81) v1(22.99,27.18) v1(23.54,41.48) v1(23.54,40.84) v1(23.54,40.21) v1(23.54,39.57) v1(23.62,29.72) v1(23.62,29.08) v1(23.62,28.45) v1(23.62,27.81) v1(23.62,27.18) v1(24.18,41.48) v1(24.18,40.84) v1(24.18,40.21) v1(24.18,39.57) v1(24.26,29.72) v1(24.26,29.08) v1(24.26,28.45) v1(24.26,27.81) v1(24.26,27.18) v1(24.81,41.48) v1(24.81,40.84) v1(24.81,40.21) v1(24.81,39.57) v1(24.89,29.72) v1(24.89,29.08) v1(24.89,28.45) v1(24.89,27.81) v1(24.89,27.18)
SH_B: length 31.7
  Top Layer w0.254: U7.15 33.68,28.35 33.17,27.84 31.25,27.84 30.89,28.2 30.89,29.16 30.04,30.01 30.04,30.16 C37.2 28.7,31.19 v1(28.7,31.8) ; 17.47,27.81 18.74,27.81 R29.1 19.57,28.03 v1(19.61,27.99)
  Inner2 w0.254: v1(28.7,31.8) 28.7,34.75 28.35,35.1 18.85,35.1 18.59,34.85 18.59,28.19 18.8,27.99 v1(19.61,27.99)
  vias: v1(13.05,41.48) v1(13.05,40.84) v1(13.05,40.21) v1(13.05,39.57) v1(12.98,29.72) v1(12.98,29.08) v1(12.98,28.45) v1(12.98,27.81) v1(12.98,27.18) v1(13.61,29.72) v1(13.61,29.08) v1(13.61,28.45) v1(13.61,27.81) v1(13.61,27.18) v1(13.68,41.48) v1(13.68,40.84) v1(13.68,40.21) v1(13.68,39.57) v1(14.25,29.72) v1(14.25,29.08) v1(14.25,28.45) v1(14.25,27.81) v1(14.25,27.18) v1(14.32,41.48) v1(14.32,40.84) v1(14.32,40.21) v1(14.32,39.57) v1(14.88,29.72) v1(14.88,29.08) v1(14.88,28.45) v1(14.88,27.81) v1(14.88,27.18) v1(14.95,41.48) v1(14.95,40.84) v1(14.95,40.21) v1(14.95,39.57) v1(15.52,29.72) v1(15.52,29.08) v1(15.52,28.45) v1(15.52,27.81) v1(15.52,27.18) v1(15.59,41.48) v1(15.59,40.84) v1(15.59,40.21) v1(15.59,39.57) v1(16.22,41.48) v1(16.22,40.84) v1(16.22,40.21) v1(16.22,39.57) v1(16.15,29.72) v1(16.15,29.08) v1(16.15,28.45) v1(16.15,27.81) v1(16.15,27.18) v1(16.79,29.72) v1(16.79,29.08) v1(16.79,28.45) v1(16.79,27.81) v1(16.79,27.18) v1(16.86,41.48) v1(16.86,40.84) v1(16.86,40.21) v1(16.86,39.57) v1(17.42,29.72) v1(17.42,29.08) v1(17.42,28.45) v1(17.42,27.81) v1(17.42,27.18) v1(17.49,41.48) v1(17.49,40.84) v1(17.49,40.21) v1(17.49,39.57)
SH_C: length 39.1
  Top Layer w0.254: v1(30.63,33.17) 29.72,33.17 ; v1(10.8,28.64) 10.92,28.64 R28.1 11.32,27.81 v1(10.06,27.81) v1(9.42,27.81) v1(8.79,27.81) v1(8.15,27.81) ; U7.12 31.34,29.53 v1(31.31,29.5)
  Inner2 w0.254: v1(10.8,28.64) 10.8,33.1 14.17,36.47 30.07,36.47 30.63,35.92 v1(30.63,33.17) 31.75,32.06 31.75,29.94 v1(31.31,29.5)
  vias: v1(5.61,29.72) v1(5.61,29.08) v1(5.61,28.45) v1(5.61,27.81) v1(5.61,27.18) v1(5.66,41.48) v1(5.66,40.84) v1(5.66,40.21) v1(5.66,39.57) v1(6.25,29.72) v1(6.25,29.08) v1(6.25,28.45) v1(6.25,27.81) v1(6.25,27.18) v1(6.3,41.48) v1(6.3,40.84) v1(6.3,40.21) v1(6.3,39.57) v1(6.93,41.48) v1(6.93,40.84) v1(6.93,40.21) v1(6.93,39.57) v1(6.88,29.72) v1(6.88,29.08) v1(6.88,28.45) v1(6.88,27.81) v1(6.88,27.18) v1(7.52,29.72) v1(7.52,29.08) v1(7.52,28.45) v1(7.52,27.81) v1(7.52,27.18) v1(7.57,41.48) v1(7.57,40.84) v1(7.57,40.21) v1(7.57,39.57) v1(8.2,41.48) v1(8.2,40.84) v1(8.2,40.21) v1(8.2,39.57) v1(8.15,29.72) v1(8.15,29.08) v1(8.15,28.45) v1(8.15,27.18) v1(8.84,41.48) v1(8.84,40.84) v1(8.84,40.21) v1(8.84,39.57) v1(8.79,29.72) v1(8.79,29.08) v1(8.79,28.45) v1(8.79,27.18) v1(9.42,29.72) v1(9.42,29.08) v1(9.42,28.45) v1(9.42,27.18) v1(9.47,41.48) v1(9.47,40.84) v1(9.47,40.21) v1(9.47,39.57) v1(10.11,41.48) v1(10.11,40.84) v1(10.11,40.21) v1(10.11,39.57) v1(10.06,29.72) v1(10.06,29.08) v1(10.06,28.45) v1(10.06,27.18)
SPI1_CS: length 8.9
  Top Layer w0.127: CN1.2 37.87,23.19 38.25,22.81 38.25,21.54 37.74,21.03 37.74,18.08 37.56,17.9 U2.16
SPI1_MISO: length 14.4
  Top Layer w0.127: CN1.4 38.05,25.69 v1(39.78,23.97) ; v1(38.76,23.98) 38.91,23.83 38.91,21.39 38.35,20.83 38.35,17.9 37.78,17.32 35.92,17.32 35.49,16.9 U2.14
  Inner2 w0.127: v1(39.78,23.97) 39.76,23.98 v1(38.76,23.98)
SPI1_MOSI: length 15.8
  Top Layer w0.127: v1(38.46,23.32) 38.56,23.22 38.56,21.44 38.05,20.93 38.05,17.95 37.73,17.63 35.81,17.63 35.59,17.4 U2.15 ; v1(40.23,23.34) 40.23,24.33 37.62,26.94 CN1.5
  Inner2 w0.127: v1(38.46,23.32) 40.22,23.32 v1(40.23,23.34)
SPI1_SCK: length 12.9
  Top Layer w0.127: U2.13 35.45,16.4 36.07,17.02 37.85,17.02 38.66,17.83 38.66,20.73 39.22,21.29 39.22,24.18 38.96,24.44 CN1.3
SPI3_CS: length 12.2
  Top Layer w0.127: v1(26.52,17.17) 26.74,17.39 26.74,17.79 27.35,18.4 U2.44
  Bottom Layer w0.127: v1(26.52,17.17) 26.52,17.93 26.39,18.06 25.85,18.06 25.84,18.07 24.84,18.07 24.83,18.06 24.61,18.06 24.44,18.24 24.44,18.75 24.28,18.9 22.91,18.9 22.35,18.34 21.54,18.34 20.98,18.9 19.43,18.9 U8.1
SPI3_MISO: length 9.1
  Top Layer w0.127: U2.42 27.23,19.4 26.42,20.22 v1(26.42,20.27)
  Bottom Layer w0.127: U8.6 26.79,22.14 27.94,20.98 27.94,20.02 27.74,19.81 26.57,19.81 26.42,19.96 v1(26.42,20.27)
SPI3_MOSI: length 12.2
  Top Layer w0.127: v1(25.76,20.25) 27.1,18.9 U2.43
  Bottom Layer w0.127: U8.5 25.97,23.41 28.25,21.13 28.25,19.86 27.94,19.56 25.86,19.56 25.76,19.66 v1(25.76,20.25)
SPI3_SCK: length 4.3
  Top Layer w0.127: U2.41 27.49,19.9 v1(27.13,20.26)
  Bottom Layer w0.127: U8.7 24.36,20.78 26.82,20.78 27.13,20.47 v1(27.13,20.26)
SWCLK: length 42.5
  Top Layer w0.127: U14.4 v1(29.64,38.35) ; U2.37 v1(28,22.45)
  Inner2 w0.127: v1(28,22.45) 28.14,22.45 30.02,24.33 31.04,24.33 32.87,22.5 40.94,22.5 41.25,22.81 41.25,34.65 40.34,35.56 37.95,35.56 34.7,38.81 29.77,38.81 29.64,38.69 v1(29.64,38.35)
SWDIO: length 39.3
  Top Layer w0.127: U2.36 28.8,23.02 v1(28.4,23.42) ; U14.3 v1(30.89,38.35)
  Inner2 w0.127: v1(30.89,38.35) 34.65,38.35 37.79,35.2 40.28,35.2 41,34.49 41,23.17 40.67,22.84 33.19,22.84 31.44,24.59 29.57,24.59 v1(28.4,23.42)
USB-DM: length 23.5
  Top Layer w0.152: 30.3,22.7 30.3,23.28 30.3,23.28 30.3,23.65 v1(30.53,23.88)
  Inner2 w0.152: v1(30.53,23.88) 30.53,23.47 33.32,20.68 33.32,19.61 33.71,19.23 39.19,19.23 39.68,18.75 39.68,12.14 v1(39.88,11.94)
  Bottom Layer w0.152: R12.2 39.73,9.45 40.08,9.8 40.08,11.73 v1(39.88,11.94)
USB-DP: length 23.5
  Top Layer w0.152: v1(29.85,23.47) 29.8,23.42 U2.34
  Inner2 w0.152: v1(29.85,23.47) 30.1,23.47 33.02,20.55 33.02,19.48 33.58,18.92 39.07,18.92 39.37,18.62 39.37,17.64 39.26,17.53 38.96,17.53 38.85,17.42 38.85,17.13 38.96,17.02 39.26,17.02 39.37,16.91 39.37,16.62 39.26,16.51 38.96,16.51 38.85,16.4 38.85,16.11 38.96,16 39.26,16 39.37,15.9 39.37,15.6 39.26,15.5 38.96,15.5 38.85,15.39 38.85,15.1 38.96,14.99 39.26,14.99 39.37,14.88 39.37,14.59 39.26,14.48 39.13,14.48 39.02,14.37 39.02,14.08 39.13,13.97 39.26,13.97 39.37,13.86 39.37,12.09 v1(39.22,11.94)
  Bottom Layer w0.152: R13.2 39.22,11.01 v1(39.22,11.94)
USB-VBUS: length 11.9
  Top Layer w0.254: 35.93,12.46 35.95,12.45 40.18,12.45 40.39,12.24 40.39,11.12 v1(40.94,10.57)
  Bottom Layer w0.254: v1(36.38,7.81) 36.38,12.45 ; D4.2 v1(40.94,10.57)
  vias: v1(36.36,12.61)
USB_DM: length 4.9
  Top Layer w0.254: 36.73,9.46 36.93,9.66 36.93,10.36 36.84,10.46 36.77,10.46 36.77,10.46 35.93,10.46 ; 36.73,9.46 35.93,9.46 ; 36.73,9.46 37.03,9.46 v1(37.75,8.74)
  Bottom Layer w0.254: 37.75,9.45 v1(37.75,8.74)
USB_DP: length 4.6
  Top Layer w0.254: 35.93,9.96 35.09,9.96 35.09,9.97 35.07,9.97 34.97,10.06 34.97,10.84 35.09,10.96 v1(36.98,10.96)
  Bottom Layer w0.254: v1(36.98,10.96) 37.74,10.96 37.75,10.97
VB_A: length 13.6
  Top Layer w0.254: v1(29.97,26.36) 29.97,25.83 D2.1 ; v1(36.5,30.12) 36.42,30.03 35.84,30.03
  Top Layer w0.305: 28.23,27.21 29.71,25.73 D2.1
  Inner2 w0.254: v1(29.97,26.36) 34.62,26.36 35.13,26.87 35.13,28.12 35.36,28.35 36.32,28.35 36.5,28.53 v1(36.5,30.12)
VB_B: length 9.7
  Top Layer w0.254: D3.1 29.79,28.68 v1(29.16,29.31) 29.08,29.31 C37.1 ; U7.17 34.68,28.13 v1(34.09,27.53)
  Inner2 w0.254: v1(34.09,27.53) 30.94,27.53 v1(29.16,29.31)
VB_C: length 9
  Top Layer w0.254: U7.14 33.18,28.46 32.97,28.25 31.6,28.25 31.5,28.35 v1(31.5,28.8) ; v1(29.83,31.03) 30.07,31.28 D5.1
  Top Layer w0.305: 29.71,31.88 30.07,31.88 ; C38.1 29.71,31.67
  Inner2 w0.254: v1(31.5,28.8) 31.14,28.8 29.83,30.11 v1(29.83,31.03)
VREF: length 33
  Top Layer w0.152: U13.1 24.16,8.05 23.93,8.28 23.93,10.26 24.59,10.93 R55.1
  Top Layer w0.254: U13.1 U13.2 ; R71.1 31.24,1.13 v1(31.24,0.56)
  Inner2 w0.203: v1(31.24,0.56) 31.24,2.49 30.99,2.74 25.3,2.74 24.84,3.2 24.84,7.11 25.09,7.37 v1(25.96,7.37) 35.05,7.37 35.31,7.62 35.31,10.16 35.05,10.41 v1(34.14,10.41)
WS2812: length 18.5
  Top Layer w0.127: U2.12 34.46,15.44 v1(35.01,15.44)
  Top Layer w0.203: v1(34.65,0.47) 33.3,0.47 LED1.2
  Bottom Layer w0.127: v1(34.65,0.47) 35.21,0.47 35.36,0.61 35.36,15.1 v1(35.01,15.44)
$1N2033: length 3.2
  Top Layer w0.254: 35.93,11.96 36.97,11.96 v1(37.04,11.89)
  Bottom Layer w0.254: R11.2 37.4,11.89 v1(37.04,11.89)
$1N2034: length 3.5
  Top Layer w0.254: v1(38.1,7.3) 38.1,7.62 36.76,8.96 35.93,8.96
  Bottom Layer w0.254: v1(38.1,7.3) 38.12,7.31 R14.1
$1N2854: length 1.5
  Top Layer w0.254: 5.93,1.12 5.95,1.14 R52.2
$1N2859: length 3.2
  Top Layer w0.254: 13.66,9.76 R7.2 12.93,7.53 U5.3
$1N3499: length 1.6
  Top Layer w0.254: L6.1 9.1,1.14 R53.2
$1N49622: length 8.2
  Top Layer w0.254: R28.2 R19.2 10.47,31.93 ; 10.47,31.93 10.72,32.17 10.72,35.29 D6.2 ; 10.47,31.93 Q1.4
$1N53821: length 6.9
  Top Layer w0.254: 19,21.32 17.68,22.64 17.68,22.83 17.18,23.33 17.18,24.33 17.48,24.33 18.95,25.81 D10.2
$1N53957: length 6.9
  Top Layer w0.254: D11.2 26.31,25.81 24.84,24.33 24.54,24.33 24.54,23.33 25.04,22.83 25.04,22.64 26.37,21.32
$1N54089: length 8.2
  Top Layer w0.254: Q2.4 17.86,31.93 ; 17.86,31.93 18.1,32.17 18.1,35.29 18.92,36.1 ; 17.86,31.93 18.92,30.87 18.92,29.53
$1N54225: length 8.2
  Top Layer w0.254: 25.28,31.93 26.34,30.87 26.34,29.53 ; 25.28,31.93 25.52,32.17 25.52,35.29 26.34,36.1 ; 25.28,31.93 Q3.4
$1N55157: length 1.6
  Top Layer w0.381: U5.4 12.23,11.13 12.03,11.33
$1N55174: length 6.3
  Top Layer w0.254: v1(12.09,6.6) 12.08,6.6 C6.2
  Inner2 w0.254: v1(10.33,10.16) 10.33,10.16 12.09,10.16 12.6,9.65 12.6,8.23 12.09,7.72 v1(12.09,6.6)
$1N55724: length 1.5
  Top Layer w0.254: L4.1 12.15,1.15 R50.2
$1N81384: length 6.9
  Top Layer w0.254: D9.2 11.53,25.81 10.06,24.33 Q4.4 9.76,23.33 R37.2 10.26,22.64 R32.2
$1N85731: length 3.5
  Top Layer w0.254: 23.27,9.76 R3.2 23.27,8.13 22.42,7.28 21.78,7.28
$1N85737: length 1.3
  Top Layer w0.305: R2.2 21.78,11.18 21.78,10.08
$1N98309: length 11.5
  Top Layer w0.127: R42.1 29.91,9.94 29.91,9.76 29.92,9.75 29.92,9.04 29.72,8.84 28.14,8.84 27.89,8.58 27.89,5.03 27.01,4.15 U13.7
$1N98311: length 7
  Top Layer w0.127: U13.5 26.27,5.45 26.52,5.69 26.52,9.17 25.92,9.76 24.59,9.76
$1N98312: length 8
  Top Layer w0.127: 28.58,9.76 27.25,9.76 27.28,9.73 27.28,5.33 26.74,4.8 U13.6
$1N98316: length 6
  Top Layer w0.127: U13.3 24.35,6.75 23.27,5.66 R82.1 23.91,4.83 23.91,3.28 R79.2
$1N98323: length 4.5
  Top Layer w0.127: U13.8 31.83,4.15 31.95,4.27 31.95,4.66 R73.2 32.72,5.33 R66.1
$1N98325: length 6.8
  Top Layer w0.127: R74.2 R72.2 31.95,8.89 31.95,5.54 31.86,5.45 U13.10
$1N98326: length 7
  Top Layer w0.127: R68.2 R66.2
  Top Layer w0.152: U13.9 30.87,4.78 v1(29.87,4.78) ; R66.2 v1(32.62,6.2)
  Inner2 w0.127: v1(32.62,6.2) 32.61,6.19 32.61,5.03 32.36,4.78 v1(29.87,4.78)
$1N98330: length 11.4
  Top Layer w0.127: R65.1 27.25,1.31 R70.2 25.92,3.17 26.31,3.56 27.18,3.56 28.4,4.78 28.4,7.87 28.57,8.05 U13.14
$1N98332: length 7
  Top Layer w0.127: R71.2 R69.2 29.41,3.14 29.41,6.6 29.56,6.75 U13.12
$1N98333: length 8.7
  Top Layer w0.127: U13.13 30.87,7.42 29.11,7.42 28.91,7.21 28.91,4.52 27.25,2.87 R65.2 R67.2

## Copper pours and planes (outline as drawn; the poured copper is in the pictures)
5V on Top Layer: 37.59,12.68 44.22,12.68 44.22,6.58 37.59,6.58
5V on Top Layer: 14.56,13.31 21.37,13.31 21.37,9.25 14.56,9.25
5V on Top Layer: 4.97,8 11.09,8 11.09,3.24 4.97,3.24
5V on Inner1: 16.18,1.94 31.48,1.94 38.46,8.91 42.32,8.91 42.32,-0.1 16.18,-0.1
5V on Inner1: 7.01,0 7.01,5.94 12.09,5.94 12.65,6.5 12.65,14.68 22.15,14.68 22.15,7.06 16.76,7.06 16.76,0
5V on Inner2: 37.18,-1.07 37.18,3.57 38.15,4.54 38.15,9.6 42.71,9.6 42.71,-0.13 41.77,-1.07
12V on Top Layer: 27.33,35.81 40.17,35.81 40.17,33.12 27.33,33.12
12V on Top Layer: 17.22,5.94 18.64,5.94 18.64,4.06 17.22,4.06
12V on Top Layer: 20.62,6.1 22.51,6.1 22.51,3.55 20.62,3.55
12V on Inner1: 29.54,27.53 29.54,32.3 34.33,32.3 34.39,32.36 34.39,35.52 26.91,35.52 26.87,35.56 26.87,27.53
12V on Inner1: 16.86,6.91 22.15,6.91 22.15,4.22 26.37,4.22 38.86,16.71 38.86,33.43 38,34.29 38,35.15 38.05,35.2 42.79,35.2 42.79,9.48 42.79,9.14 38.41,9.14 31.44,2.18 16.86,2.18
GND on Top Layer: 26.82,14.68 23.93,14.68 23.93,13.58 22.71,13.58 22.71,12.08 24.03,12.08 24.03,4.85 24.08,4.8 24,4.72 22.66,4.72 22.66,3.61 5.33,3.61 5.33,0 42.01,0 42.01,42.01 26.88,42.01 26.88,14.74
GND on Bottom Layer: 26.87,33.22 35.4,33.22 35.4,25.4 35.31,25.3 23.23,25.3 23.23,19.01 24.24,19.01 24.24,0 42.01,0 42.01,42.01 26.87,42.01
GND on Inner2: -0.97,3.76 46.23,3.76 46.23,-0.71 -0.97,-0.71
GND on Inner2: 26.87,37.85 34.76,37.85 37.67,34.94 39.13,34.94 40.13,33.93 40.13,24.2 26.94,24.2 26.87,24.13 26.87,14.68 24.03,14.68 24.03,0 42.01,0 42.01,42.01 26.85,42.01 26.85,37.87
PGND on Top Layer: 14.63,13.26 16.41,13.26 16.41,11.38 14.63,11.38
PGND on Top Layer: 5.03,13.26 6.81,13.26 6.81,11.38 5.03,11.38
PGND on Top Layer: 0,28.11 4.93,28.11 4.93,22.54 2.21,22.54 2.21,6.21 0,6.21
PGND on Top Layer: 10.31,9.04 12.18,9.04 12.18,6.93 10.31,6.93
PGND on Top Layer: 19.86,9.1 21.73,9.1 21.73,6.48 19.86,6.48
PGND on Top Layer: 5.08,5.94 6.86,5.94 6.86,4.06 5.08,4.06
PGND on Top Layer: 22.61,13.46 22.61,11.84 23.85,11.84 23.85,6.2 22.26,6.2 22.26,3.2 5.13,3.2 5.13,0 -0.02,0 -0.02,6.12 4.62,6.12 4.62,13.46
PGND on Top Layer: 14.63,5.94 16.41,5.94 16.41,4.06 14.63,4.06
PGND on Top Layer: 5.03,18.59 6.15,18.59 6.3,18.44 6.3,17.78 8.15,17.78 8.15,18.46 8.28,18.59 9.4,18.59 9.4,16.56 12.38,16.56 12.38,18.59 13.51,18.59 13.61,18.49 13.61,17.76 15.52,17.76 15.52,18.47 15.65,18.59 16.77,18.59 16.77,16.56 19.74,16.56 19.74,18.57 19.76,18.59 20.88,18.59 21.03,18.44 21.03,17.77 22.91,17.77 22.91,18.5 23.01,18.59 24.15,18.59 24.15,15.85 26.62,15.85 26.62,14.85 22.15,14.85 22.15,13.57 5.04,13.57 5.03,13.56
PGND on Bottom Layer: 5,28.96 5,26.82 26.93,26.82 26.93,33.09 35.3,33.09 35.3,25.43 19.76,25.43 19.76,18.49 24.18,18.49 24.18,14.69 24.18,14.68 24.03,14.68 24.03,0 0,0 0,28.96
PGND on Inner1: 0,6.09 6.96,6.09 6.96,-1.27 0,-1.27
PGND on Inner2: 0,0 0,28.97 0.01,28.96 5,28.96 5,18.31 24.17,18.31 24.17,14.82 23.93,14.58 23.93,3.86 5.18,3.86 5.13,3.91 5.13,0
VCC on Inner1: 26.82,14.68 22.66,14.68 22.66,0 42.01,0 42.01,42.01 26.88,42.01 26.88,14.74
DCBUS on Top Layer: 9.97,18.89 11.84,18.89 11.84,16.66 9.97,16.66
DCBUS on Top Layer: 10.77,9.19 11.68,9.19 11.68,10.49 11.23,10.95 11.23,13.46 7.26,13.46 7.26,11.32 9.87,11.32 9.87,10.55 10.63,10.55 10.77,10.41
DCBUS on Top Layer: 24.74,18.9 26.56,18.9 26.56,16.66 24.74,16.66
DCBUS on Top Layer: 2.59,22.25 4.37,22.25 4.37,6.23 2.59,6.23
DCBUS on Top Layer: 17.33,18.89 19.2,18.89 19.2,16.66 17.33,16.66
DCBUS on Top Layer: 0,31.12 4.92,31.12 4.92,32.97 10.46,32.97 10.46,36.83 12.66,36.83 12.66,32.98 12.65,32.97 17.85,32.97 17.85,36.83 20.08,36.83 20.08,32.97 25.26,32.97 25.26,43.95 0,43.95
DCBUS on Bottom Layer: 0,29.14 4.92,29.14 4.92,32.97 10.46,32.97 10.46,36.83 12.66,36.83 12.66,32.98 12.65,32.97 17.85,32.97 17.85,36.83 20.08,36.83 20.08,32.97 25.26,32.97 25.26,43.95 0,43.95
DCBUS on Inner1: 25.96,17.88 25.96,16.66 12.55,16.66 12.55,6.2 0,6.2 0,42.01 25.96,42.01 25.96,17.88
DCBUS on Inner2: 0,29.14 4.92,29.14 4.92,32.97 10.46,32.97 10.46,32.98 12.66,32.98 12.65,32.97 25.26,32.97 25.26,43.95 0,43.95
IA+ on Top Layer: 20.04,20.53 20.04,25.16 24,25.16 24,20.53
IB+ on Top Layer: 12.62,20.53 12.62,25.16 16.58,25.16 16.58,20.53
IC+ on Top Layer: 5.23,20.52 5.23,25.15 9.19,25.15 9.19,20.52
SH_A on Top Layer: 20.06,32.78 23.95,32.78 23.95,31.04 25.27,31.04 25.27,25.39 20.06,25.39
SH_A on Bottom Layer: 20.06,42.52 25.27,42.52 25.27,26.86 20.06,26.86
SH_A on Inner1: 20.06,42.52 25.27,42.52 25.27,26.86 20.06,26.86
SH_A on Inner2: 20.19,29.98 25.14,29.98 25.14,26.91 20.19,26.91
SH_A on Inner2: 20.09,41.76 25.07,41.76 25.07,39.32 20.09,39.32
SH_B on Top Layer: 12.64,32.78 16.53,32.78 16.53,31.04 17.85,31.04 17.85,25.39 12.64,25.39
SH_B on Bottom Layer: 12.64,42.52 17.85,42.52 17.85,26.86 12.64,26.86
SH_B on Inner1: 12.64,42.52 17.85,42.52 17.85,26.86 12.64,26.86
SH_B on Inner2: 12.77,41.76 17.75,41.76 17.75,39.32 12.77,39.32
SH_B on Inner2: 12.74,29.98 17.69,29.98 17.69,26.91 12.74,26.91
SH_C on Top Layer: 5.26,32.78 9.14,32.78 9.14,31.04 10.47,31.04 10.47,25.39 5.26,25.39
SH_C on Bottom Layer: 5.26,42.52 10.47,42.52 10.47,26.86 5.26,26.86
SH_C on Inner1: 5.26,42.52 10.47,42.52 10.47,26.86 5.26,26.86
SH_C on Inner2: 5.36,29.98 10.3,29.98 10.3,26.91 5.36,26.91
SH_C on Inner2: 5.38,41.76 10.36,41.76 10.36,39.32 5.38,39.32
$1N55187 on Top Layer: 4.98,10.97 11.05,10.97 11.05,5.58 4.98,5.58
$1N122508 on Top Layer: 14.6,7.98 20.22,7.98 20.22,5.18 14.6,5.18

Small or netless copper shapes (teardrops, artwork), in the pictures only: 423 on Top Layer, 90 on Bottom Layer, 2 on Inner1, 86 on Inner2

## Text on the board
Bottom Silkscreen Layer: Zhang-FOCDRIVER | FDCAN | CAN_H  CAN_L | CLK DIO GND VCC | SWD | SPI | MO MI SCK CS VCC | RST | C | B | A
Top Silkscreen Layer: JLCJLCJLCJLC | #STM32G :)
